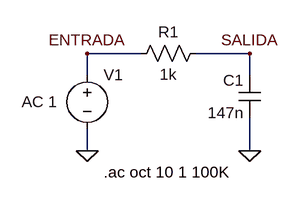
[diagram p0: schematic filtro-paso-bajo.asc]
filtro-paso-bajo.asc, the LTspice schematic file:
Version 4
SHEET 1 880 680
WIRE 128 96 48 96
WIRE 288 96 208 96
WIRE 48 128 48 96
WIRE 288 128 288 96
WIRE 48 240 48 208
WIRE 288 240 288 192
FLAG 288 240 0
FLAG 48 240 0
FLAG 48 96 ENTRADA
FLAG 288 96 SALIDA
SYMBOL res 224 80 R90
WINDOW 0 0 56 VBottom 2
WINDOW 3 32 56 VTop 2
SYMATTR InstName R1
SYMATTR Value 1k
SYMBOL cap 304 192 R180
WINDOW 0 24 56 Left 2
WINDOW 3 24 8 Left 2
SYMATTR InstName C1
SYMATTR Value 147n
SYMBOL voltage 48 112 R0
WINDOW 123 -97 56 Left 2
WINDOW 39 0 0 Left 0
SYMATTR InstName V1
SYMATTR Value ""
SYMATTR Value2 AC 1
TEXT 72 272 Left 2 !.ac oct 10 1 100K

The netlist it stands for:
* filtro-paso-bajo.asc
R1 SALIDA ENTRADA 1k
C1 0 SALIDA 147n
V1 ENTRADA 0 AC 1
.ac oct 10 1 100K
.backanno
.end